# EAGLE design MotorShield (EAGLE 9.6.0)
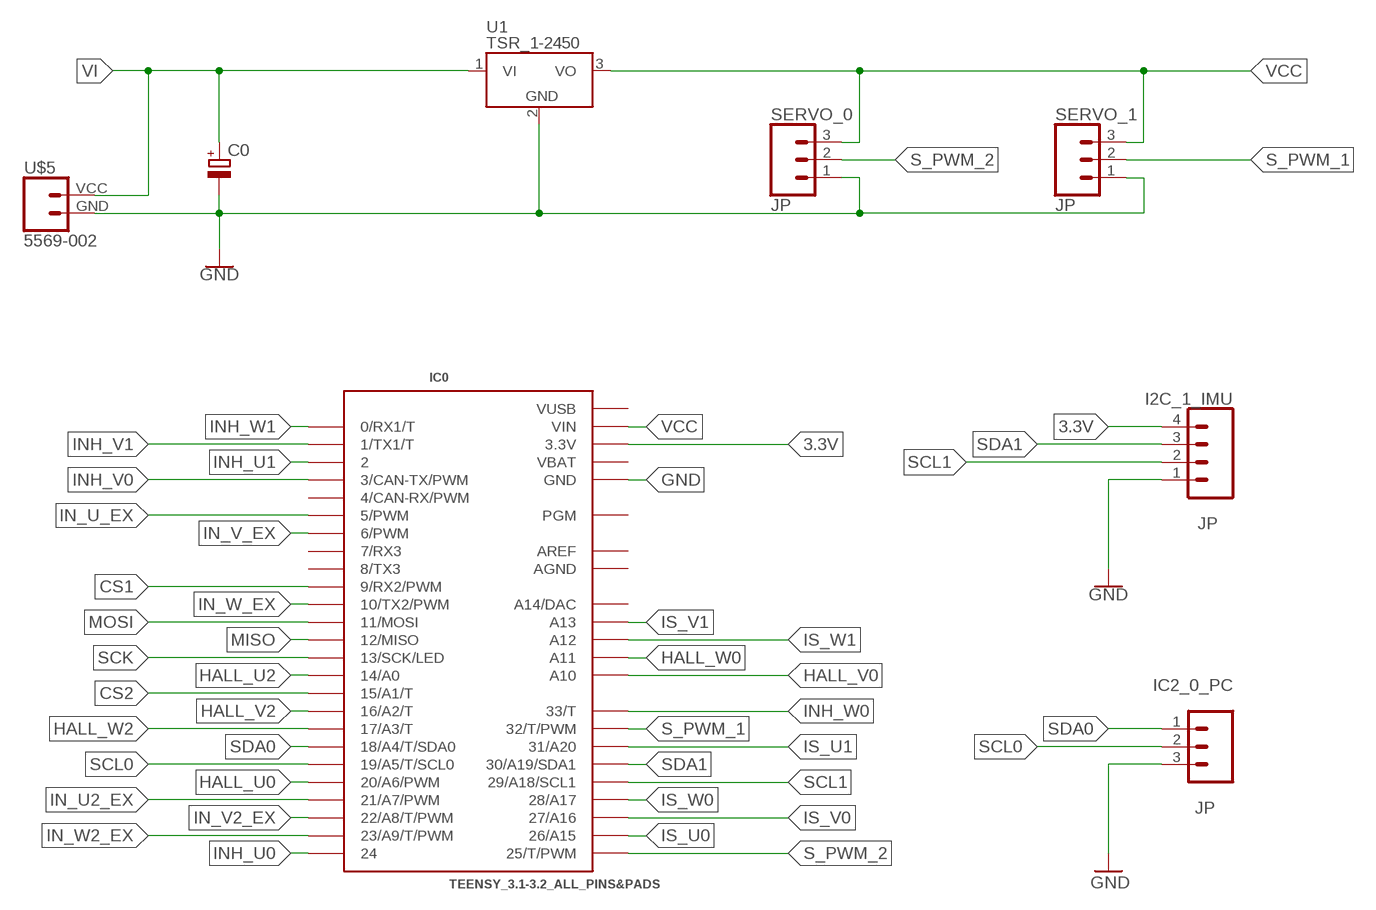
[diagram p0: schematic, sheet 1, part 1 of 2]
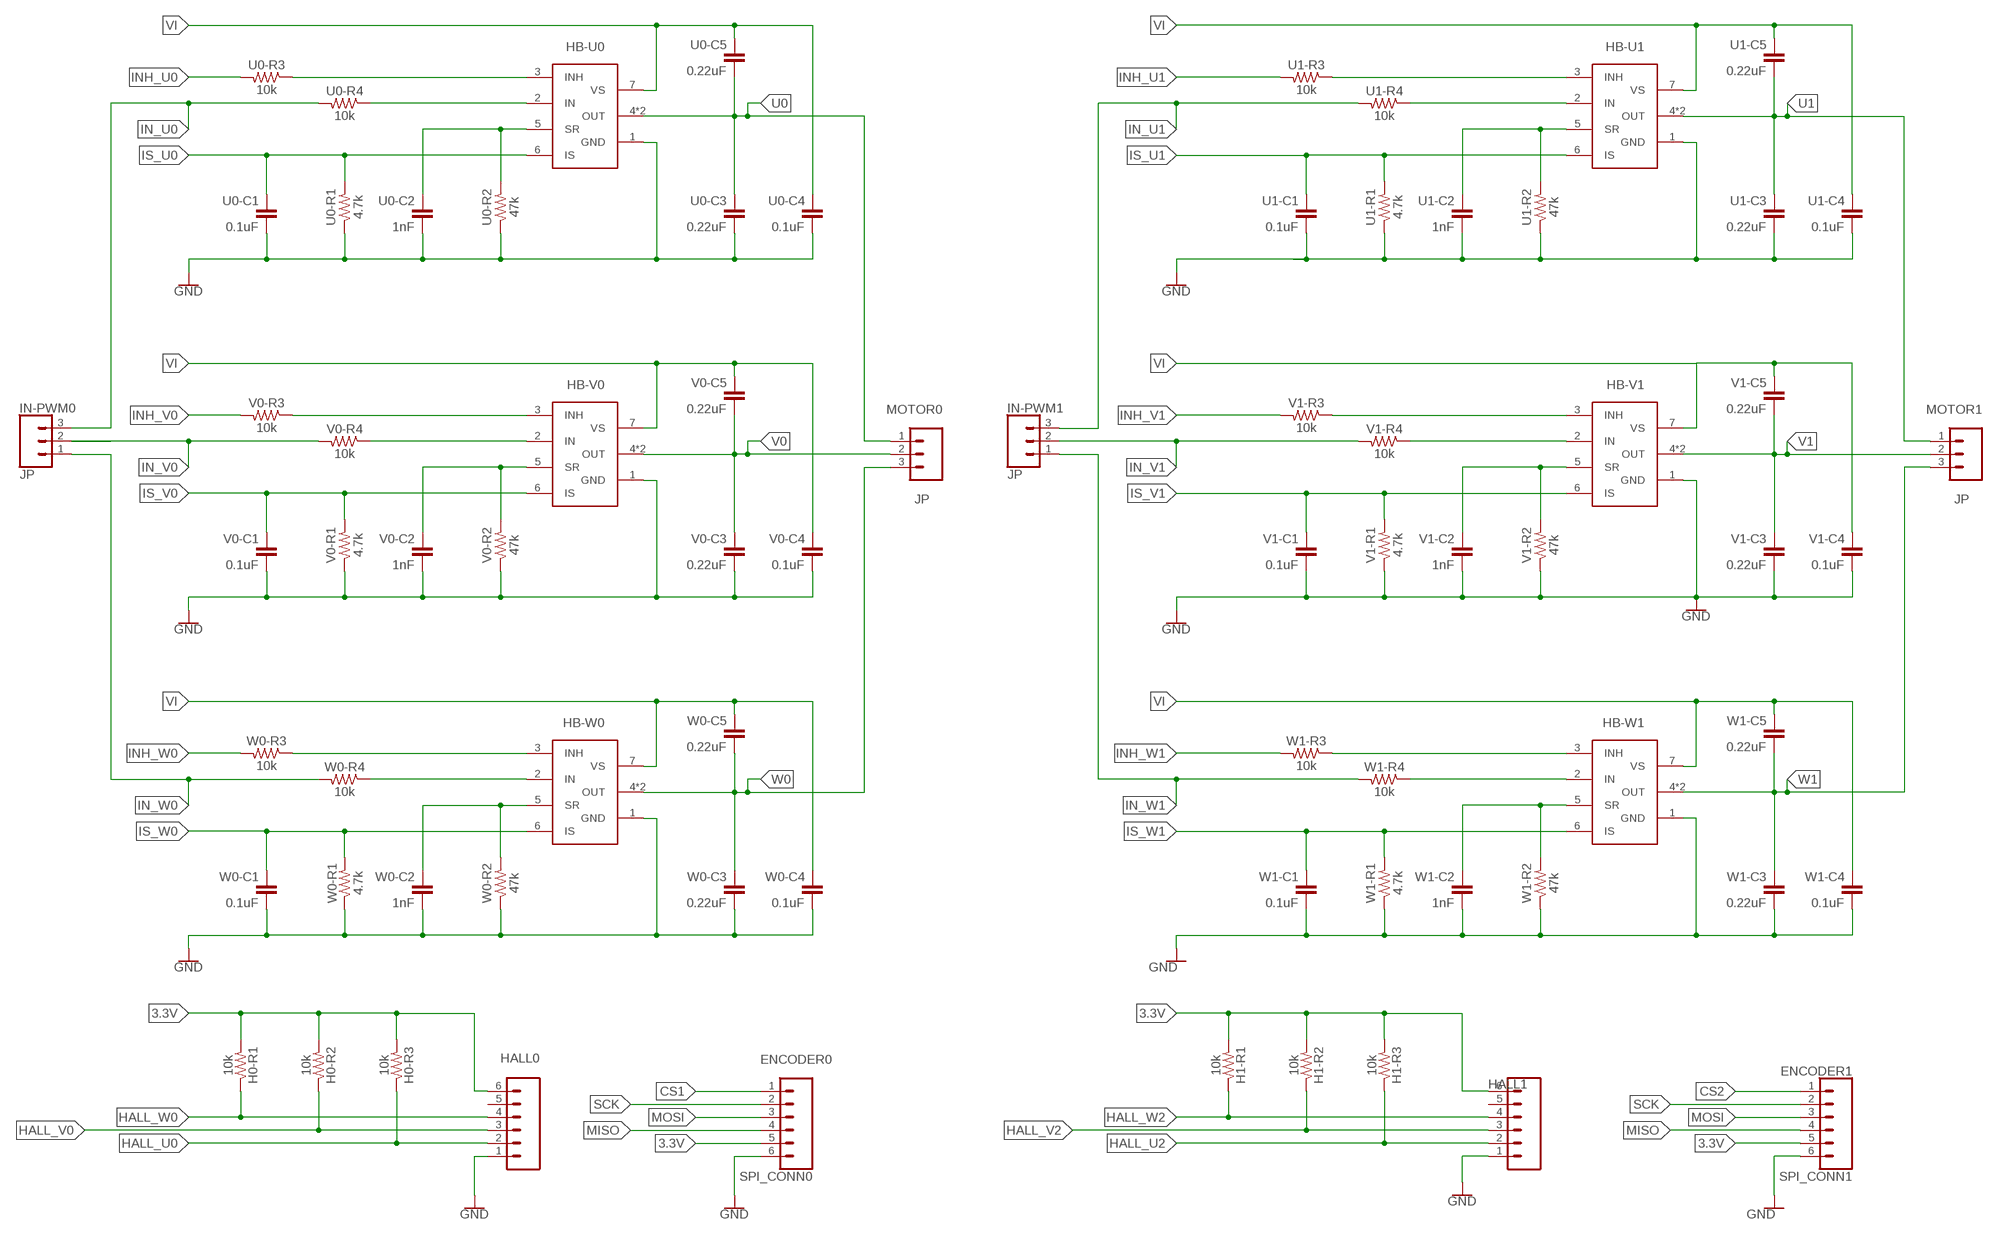
[diagram p1: schematic, sheet 1, part 2 of 2]

## Parts
C0  CPOL-EUE2,5-6E  [E2,5-6E]
H0-R1  10k  10KOHM-0603-1/10W-1%  [0603]
H0-R2  10k  10KOHM-0603-1/10W-1%  [0603]
H0-R3  10k  10KOHM-0603-1/10W-1%  [0603]
H1-R1  10k  10KOHM-0603-1/10W-1%  [0603]
H1-R2  10k  10KOHM-0603-1/10W-1%  [0603]
H1-R3  10k  10KOHM-0603-1/10W-1%  [0603]
HALL0  CONN_06SMD-1MM  [1X06-1MM]
HALL1  CONN_06SMD-1MM  [1X06-1MM]
HB-U0  IFX007TZZZZ  [P-TO263-7-1]
HB-U1  IFX007TZZZZ  [P-TO263-7-1]
HB-V0  IFX007TZZZZ  [P-TO263-7-1]
HB-V1  IFX007TZZZZ  [P-TO263-7-1]
HB-W0  IFX007TZZZZ  [P-TO263-7-1]
HB-W1  IFX007TZZZZ  [P-TO263-7-1]
I2C_1_IMU  JP  CONN_041X04_NO_SILK  [1X04_NO_SILK]
IC0  TEENSY_3.1-3.2_ALL_PINS&PADS  [TEENSY_3.0-3.2_ALL_PINS_&_PADS]
IC2_0_PC  JP  CONN_031X03_NO_SILK  [1X03_NO_SILK]
IN-PWM0  JP  CONN_031X03_NO_SILK  [1X03_NO_SILK]
IN-PWM1  JP  CONN_031X03_NO_SILK  [1X03_NO_SILK]
MOTOR0  JP  CONN_031X03_NO_SILK  [1X03_NO_SILK]
MOTOR1  JP  CONN_031X03_NO_SILK  [1X03_NO_SILK]
SERVO_0  JP  CONN_031X03_NO_SILK  [1X03_NO_SILK]
SERVO_1  JP  CONN_031X03_NO_SILK  [1X03_NO_SILK]
SPI_CONN0  ENCODER0  CONN_06SMD-1MM  [1X06-1MM]
SPI_CONN1  ENCODER1  CONN_06SMD-1MM  [1X06-1MM]
U0-C1  0.1uF  0.1UF-0603-25V-5%  [0603]
U0-C2  1nF  1.0NF/1000PF-0603-50V-10%  [0603]
U0-C3  0.22uF  0.22UF-0603-25V-10%  [0603]
U0-C4  0.1uF  0.1UF-0603-25V-5%  [0603]
U0-C5  0.22uF  0.22UF-0603-25V-10%  [0603]
U0-R1  4.7k  4.7KOHM-0603-1/10W-1%  [0603]
U0-R2  47k  47KOHM-0603-1/10W-1%  [0603]
U0-R3  10k  10KOHM-0603-1/10W-1%  [0603]
U0-R4  10k  10KOHM-0603-1/10W-1%  [0603]
U1  TSR_1-2450  [TSR-1]
U1-C1  0.1uF  0.1UF-0603-25V-5%  [0603]
U1-C2  1nF  1.0NF/1000PF-0603-50V-10%  [0603]
U1-C3  0.22uF  0.22UF-0603-25V-10%  [0603]
U1-C4  0.1uF  0.1UF-0603-25V-5%  [0603]
U1-C5  0.22uF  0.22UF-0603-25V-10%  [0603]
U1-R1  4.7k  4.7KOHM-0603-1/10W-1%  [0603]
U1-R2  47k  47KOHM-0603-1/10W-1%  [0603]
U1-R3  10k  10KOHM-0603-1/10W-1%  [0603]
U1-R4  10k  10KOHM-0603-1/10W-1%  [0603]
U$5  5569-002  [5569-002]
V0-C1  0.1uF  0.1UF-0603-25V-5%  [0603]
V0-C2  1nF  1.0NF/1000PF-0603-50V-10%  [0603]
V0-C3  0.22uF  0.22UF-0603-25V-10%  [0603]
V0-C4  0.1uF  0.1UF-0603-25V-5%  [0603]
V0-C5  0.22uF  0.22UF-0603-25V-10%  [0603]
V0-R1  4.7k  4.7KOHM-0603-1/10W-1%  [0603]
V0-R2  47k  47KOHM-0603-1/10W-1%  [0603]
V0-R3  10k  10KOHM-0603-1/10W-1%  [0603]
V0-R4  10k  10KOHM-0603-1/10W-1%  [0603]
V1-C1  0.1uF  0.1UF-0603-25V-5%  [0603]
V1-C2  1nF  1.0NF/1000PF-0603-50V-10%  [0603]
V1-C3  0.22uF  0.22UF-0603-25V-10%  [0603]
V1-C4  0.1uF  0.1UF-0603-25V-5%  [0603]
V1-C5  0.22uF  0.22UF-0603-25V-10%  [0603]
V1-R1  4.7k  4.7KOHM-0603-1/10W-1%  [0603]
V1-R2  47k  47KOHM-0603-1/10W-1%  [0603]
V1-R3  10k  10KOHM-0603-1/10W-1%  [0603]
V1-R4  10k  10KOHM-0603-1/10W-1%  [0603]
W0-C1  0.1uF  0.1UF-0603-25V-5%  [0603]
W0-C2  1nF  1.0NF/1000PF-0603-50V-10%  [0603]
W0-C3  0.22uF  0.22UF-0603-25V-10%  [0603]
W0-C4  0.1uF  0.1UF-0603-25V-5%  [0603]
W0-C5  0.22uF  0.22UF-0603-25V-10%  [0603]
W0-R1  4.7k  4.7KOHM-0603-1/10W-1%  [0603]
W0-R2  47k  47KOHM-0603-1/10W-1%  [0603]
W0-R3  10k  10KOHM-0603-1/10W-1%  [0603]
W0-R4  10k  10KOHM-0603-1/10W-1%  [0603]
W1-C1  0.1uF  0.1UF-0603-25V-5%  [0603]
W1-C2  1nF  1.0NF/1000PF-0603-50V-10%  [0603]
W1-C3  0.22uF  0.22UF-0603-25V-10%  [0603]
W1-C4  0.1uF  0.1UF-0603-25V-5%  [0603]
W1-C5  0.22uF  0.22UF-0603-25V-10%  [0603]
W1-R1  4.7k  4.7KOHM-0603-1/10W-1%  [0603]
W1-R2  47k  47KOHM-0603-1/10W-1%  [0603]
W1-R3  10k  10KOHM-0603-1/10W-1%  [0603]
W1-R4  10k  10KOHM-0603-1/10W-1%  [0603]

## Nets
3.3V: H0-R1.2 H0-R2.2 H0-R3.2 H1-R1.2 H1-R2.2 H1-R3.2 HALL0.6 HALL1.6 I2C_1_IMU.4 IC0.3.3V IC0.3.3V1(3.3V) IC0.3.3V2(3.3V) SPI_CONN0.5 SPI_CONN1.5
CS1: IC0.9(9/RX2/PWM) SPI_CONN0.1
CS2: IC0.15/A1(15/A1/T) SPI_CONN1.1
GND: C0.- HALL0.1 HALL1.1 HB-U0.1(GND) HB-U1.1(GND) HB-V0.1(GND) HB-V1.1(GND) HB-W0.1(GND) HB-W1.1(GND) I2C_1_IMU.1 IC0.GND IC0.GND1(GND) IC0.GND2(GND) IC2_0_PC.3 SERVO_0.1 SERVO_1.1 SPI_CONN0.6 SPI_CONN1.6 U0-C1.2 U0-C2.1 U0-C3.1 U0-C4.2 U0-R1.1 U0-R2.1 U1-C1.2 U1-C2.1 U1-C3.1 U1-C4.2 U1-R1.1 U1-R2.1 U1.2(GND) U$5.GND V0-C1.2 V0-C2.1 V0-C3.1 V0-C4.2 V0-R1.1 V0-R2.1 V1-C1.2 V1-C2.1 V1-C3.1 V1-C4.2 V1-R1.1 V1-R2.1 W0-C1.2 W0-C2.1 W0-C3.1 W0-C4.2 W0-R1.1 W0-R2.1 W1-C1.2 W1-C2.1 W1-C3.1 W1-C4.2 W1-R1.1 W1-R2.1
HALL_U0: H0-R3.1 HALL0.2 IC0.20/A6(20/A6/PWM)
HALL_U2: H1-R3.1 HALL1.2 IC0.14/A0
HALL_V0: H0-R2.1 HALL0.3 IC0.A10
HALL_V2: H1-R2.1 HALL1.3 IC0.16/A2(16/A2/T)
HALL_W0: H0-R1.1 HALL0.4 IC0.A11
HALL_W2: H1-R1.1 HALL1.4 IC0.17/A3(17/A3/T)
IN_U0: IN-PWM0.3 U0-R4.2
IN_U1: IN-PWM1.3 U1-R4.2
IN_U2_EX: IC0.21/A7(21/A7/PWM)
IN_U_EX: IC0.5(5/PWM)
IN_V0: IN-PWM0.2 V0-R4.2
IN_V1: IN-PWM1.2 V1-R4.2
IN_V2_EX: IC0.22/A8(22/A8/T/PWM)
IN_V_EX: IC0.6(6/PWM)
IN_W0: IN-PWM0.1 W0-R4.2
IN_W1: IN-PWM1.1 W1-R4.2
IN_W2_EX: IC0.23/A9(23/A9/T/PWM)
IN_W_EX: IC0.10(10/TX2/PWM)
INH_U0: IC0.24 U0-R3.2
INH_U1: IC0.2 U1-R3.2
INH_V0: IC0.3(3/CAN-TX/PWM) V0-R3.2
INH_V1: IC0.1(1/TX1/T) V1-R3.2
INH_W0: IC0.33(33/T) W0-R3.2
INH_W1: IC0.0(0/RX1/T) W1-R3.2
IS_U0: HB-U0.6(IS) IC0.26(26/A15) U0-C1.1 U0-R1.2
IS_U1: HB-U1.6(IS) IC0.31(31/A20) U1-C1.1 U1-R1.2
IS_V0: HB-V0.6(IS) IC0.27(27/A16) V0-C1.1 V0-R1.2
IS_V1: HB-V1.6(IS) IC0.A13 V1-C1.1 V1-R1.2
IS_W0: HB-W0.6(IS) IC0.28(28/A17) W0-C1.1 W0-R1.2
IS_W1: HB-W1.6(IS) IC0.A12 W1-C1.1 W1-R1.2
MISO: IC0.12(12/MISO) SPI_CONN0.4 SPI_CONN1.4
MOSI: IC0.11(11/MOSI) SPI_CONN0.3 SPI_CONN1.3
N$1: HB-W0.3(INH) W0-R3.1
N$2: HB-V0.5(SR) V0-C2.2 V0-R2.2
N$3: HB-W0.5(SR) W0-C2.2 W0-R2.2
N$10: HB-U0.5(SR) U0-C2.2 U0-R2.2
N$11: HB-U0.3(INH) U0-R3.1
N$14: HB-U0.2(IN) U0-R4.1
N$17: HB-U1.3(INH) U1-R3.1
N$18: HB-V0.3(INH) V0-R3.1
N$19: HB-U1.2(IN) U1-R4.1
N$20: HB-W0.2(IN) W0-R4.1
N$23: HB-U1.5(SR) U1-C2.2 U1-R2.2
N$24: HB-V0.2(IN) V0-R4.1
N$26: HB-V1.3(INH) V1-R3.1
N$27: HB-V1.2(IN) V1-R4.1
N$29: HB-V1.5(SR) V1-C2.2 V1-R2.2
N$30: HB-W1.3(INH) W1-R3.1
N$31: HB-W1.2(IN) W1-R4.1
N$33: HB-W1.5(SR) W1-C2.2 W1-R2.2
S_PWM_1: IC0.32(32/T/PWM) SERVO_1.2
S_PWM_2: IC0.25(25/T/PWM) SERVO_0.2
SCK: IC0.13(13/SCK/LED) SPI_CONN0.2 SPI_CONN1.2
SCL0: IC0.19/A5(19/A5/T/SCL0) IC2_0_PC.2
SCL1: I2C_1_IMU.2 IC0.29(29/A18/SCL1)
SDA0: IC0.18/A4(18/A4/T/SDA0) IC2_0_PC.1
SDA1: I2C_1_IMU.3 IC0.30(30/A19/SDA1)
U0: HB-U0.4(OUT) HB-U0.8(OUT) MOTOR0.1 U0-C3.2 U0-C5.2
U1: HB-U1.4(OUT) HB-U1.8(OUT) MOTOR1.1 U1-C3.2 U1-C5.2
V0: HB-V0.4(OUT) HB-V0.8(OUT) MOTOR0.2 V0-C3.2 V0-C5.2
V1: HB-V1.4(OUT) HB-V1.8(OUT) MOTOR1.2 V1-C3.2 V1-C5.2
VCC: IC0.VIN SERVO_0.3 SERVO_1.3 U1.3(VO)
VI: C0.+ HB-U0.7(VS) HB-U1.7(VS) HB-V0.7(VS) HB-V1.7(VS) HB-W0.7(VS) HB-W1.7(VS) U0-C4.1 U0-C5.1 U1-C4.1 U1-C5.1 U1.1(VI) U$5.VCC V0-C4.1 V0-C5.1 V1-C4.1 V1-C5.1 W0-C4.1 W0-C5.1 W1-C4.1 W1-C5.1
W0: HB-W0.4(OUT) HB-W0.8(OUT) MOTOR0.3 W0-C3.2 W0-C5.2
W1: HB-W1.4(OUT) HB-W1.8(OUT) MOTOR1.3 W1-C3.2 W1-C5.2
Unconnected: HALL0.5 HALL1.5 IC0.4(4/CAN-RX/PWM) IC0.7(7/RX3) IC0.8(8/TX3) IC0.PGM IC0.RESET/DAC(A14/DAC)

## Power pins joined to a net without a drawn wire
AGND: IC0.AGND
AREF: IC0.AREF
VBAT: IC0.VBAT
VUSB: IC0.VUSB

## Library data of the parts
C0 = rcl:CPOL-EU: POLARIZED CAPACITOR, European symbol; SPICEPREFIX: C
H0-R1-H0-R3 H1-R1-H1-R3 U0-R3 U0-R4 U1-R3 U1-R4 V0-R3 V0-R4 V1-R3 V1-R4 W0-R3 W0-R4 W1-R3 W1-R4 = SparkFun-Resistors:10KOHM: 10kΩ resistor A resistor is a passive two-terminal electrical component that implements electrical resistance as a circuit element. Resistors act to reduce current flow, and, at the same time, act to lower voltage levels within circuits. - Wikipedia; PROD_ID: RES-00824
HALL0 HALL1 SPI_CONN0 SPI_CONN1 = SparkFun-Connectors:CONN_06: Multi connection point. Often used as Generic Header-pin footprint for 0.1 inch spaced/style header connections On any of the 0.1 inch spaced packages, you can populate with these: Break Away Headers - Straight (PRT-00116) Break Away Male Headers - Right Angle (PRT-00553) Female Headers (PRT-00115) Break Away Headers - Machine Pin (PRT-00117) Break Away Female Headers - Swiss Machine Pin (PRT-00743) Arduino Stackable Header - 6 Pin (PRT-09280) For SCREWTERMINALS and SPRING TERMINALS visit here: Screw Terimnals on SparkFun.com (5mm/3.5mm/2.54mm spacing) This device is also useful as a general connection point to wire up your design to another part of your project. Our various solder wires solder well into these plated through hole pads. Hook-Up Wire - Assortment (Stranded, 22 AWG) (PRT-11375) Hook-Up Wire - Assortment (Solid Core, 22 AWG) (PRT-11367) View the entire wire category on our website here; PROD_ID: CONN-08249; SF_ID: GPS-00579
HB-U0 HB-U1 HB-V0 HB-V1 HB-W0 HB-W1 = ITX007T:IFX007T
I2C_1_IMU = SparkFun-Connectors:CONN_04: Multi connection point. Often used as Generic Header-pin footprint for 0.1 inch spaced/style header connections On any of the 0.1 inch spaced packages, you can populate with these: Break Away Headers - Straight (PRT-00116) Break Away Male Headers - Right Angle (PRT-00553) Female Headers (PRT-00115) Break Away Headers - Machine Pin (PRT-00117) Break Away Female Headers - Swiss Machine Pin (PRT-00743) For SCREWTERMINALS and SPRING TERMINALS visit here: Screw Terimnals on SparkFun.com (5mm/3.5mm/2.54mm spacing) This device is also useful as a general connection point to wire up your design to another part of your project. Our various solder wires solder well into these plated through hole pads. Hook-Up Wire - Assortment (Stranded, 22 AWG) (PRT-11375) Hook-Up Wire - Assortment (Solid Core, 22 AWG) (PRT-11367) View the entire wire category on our website here Special notes: Molex polarized connector foot print use with SKU : PRT-08231 with associated crimp pins and housings. 1MM SMD Version SKU: PRT-10208; PROD_ID: CONN-09696
IC0 = Teensy_3_and_LC_Series_Boards_v1.4:TEENSY_3.1-3.2_ALL_PINS&PADS: Footprint for Teensy 3.1 or 3.2 board using all pads and all through-holes. Pads need a 2x7 0.1" SMD header.
IC2_0_PC IN-PWM0 MOTOR0 MOTOR1 SERVO_0 SERVO_1 = SparkFun-Connectors:CONN_03: Multi connection point. Often used as Generic Header-pin footprint for 0.1 inch spaced/style header connections On any of the 0.1 inch spaced packages, you can populate with these: Break Away Headers - Straight (PRT-00116) Break Away Male Headers - Right Angle (PRT-00553) Female Headers (PRT-00115) Break Away Headers - Machine Pin (PRT-00117) Break Away Female Headers - Swiss Machine Pin (PRT-00743) Stackable Header - 3 Pin (Female, 0.1") (PRT-13875) For SCREWTERMINALS and SPRING TERMINALS visit here: Screw Terimnals on SparkFun.com (5mm/3.5mm/2.54mm spacing) This device is also useful as a general connection point to wire up your design to another part of your project. Our various solder wires solder well into these plated through hole pads. Hook-Up Wire - Assortment (Stranded, 22 AWG) (PRT-11375) Hook-Up Wire - Assortment (Solid Core, 22 AWG) (PRT-11367) View the entire wire category on our website here Special notes: Molex polarized connector foot print use with SKU : PRT-08232 with associated crimp pins and housings.
IN-PWM1 = SparkFun-Connectors:CONN_03: Multi connection point. Often used as Generic Header-pin footprint for 0.1 inch spaced/style header connections On any of the 0.1 inch spaced packages, you can populate with these: Break Away Headers - Straight (PRT-00116) Break Away Male Headers - Right Angle (PRT-00553) Female Headers (PRT-00115) Break Away Headers - Machine Pin (PRT-00117) Break Away Female Headers - Swiss Machine Pin (PRT-00743) Stackable Header - 3 Pin (Female, 0.1") (PRT-13875) For SCREWTERMINALS and SPRING TERMINALS visit here: Screw Terimnals on SparkFun.com (5mm/3.5mm/2.54mm spacing) This device is also useful as a general connection point to wire up your design to another part of your project. Our various solder wires solder well into these plated through hole pads. Hook-Up Wire - Assortment (Stranded, 22 AWG) (PRT-11375) Hook-Up Wire - Assortment (Solid Core, 22 AWG) (PRT-11367) View the entire wire category on our website here Special notes: Molex polarized connector foot print use with SKU : PRT-08232 with associated crimp pins and housings.; SPICEPREFIX: J
U0-C1 U0-C4 U1-C1 U1-C4 V0-C1 V0-C4 V1-C1 V1-C4 W0-C1 W0-C4 W1-C1 W1-C4 = SparkFun-Capacitors:0.1UF: 0.1µF ceramic capacitors A capacitor is a passive two-terminal electrical component used to store electrical energy temporarily in an electric field.; PROD_ID: CAP-08604
U0-C2 U1-C2 V0-C2 V1-C2 W0-C2 W1-C2 = SparkFun-Capacitors:1.0NF/1000PF: 1nF/1,000pF ceramic capacitors A capacitor is a passive two-terminal electrical component used to store electrical energy temporarily in an electric field.; PROD_ID: CAP-07886
U0-C3 U0-C5 U1-C3 U1-C5 V0-C3 V0-C5 V1-C3 V1-C5 W0-C3 W0-C5 W1-C3 W1-C5 = SparkFun-Capacitors:0.22UF: 0.22µF ceramic capacitors A capacitor is a passive two-terminal electrical component used to store electrical energy temporarily in an electric field.; PROD_ID: CAP-07822
U0-R1 U1-R1 V0-R1 V1-R1 W0-R1 W1-R1 = SparkFun-Resistors:4.7KOHM: 4.7kΩ resistor A resistor is a passive two-terminal electrical component that implements electrical resistance as a circuit element. Resistors act to reduce current flow, and, at the same time, act to lower voltage levels within circuits. - Wikipedia; PROD_ID: RES-07857
U0-R2 U1-R2 V0-R2 V1-R2 W0-R2 W1-R2 = SparkFun-Resistors:47KOHM: 47kΩ resistor A resistor is a passive two-terminal electrical component that implements electrical resistance as a circuit element. Resistors act to reduce current flow, and, at the same time, act to lower voltage levels within circuits. - Wikipedia; PROD_ID: RES-07871
U1 = _traco_tsr-1:TSR_1-*: TRACO TSR-1 Series Point-of-Load DC/DC-Converters Vi max. 36 V; Vo = (1.2 .. 15)V ±2%; Io = 0 .. 1 A SIP-Package (drop-in replacement for 78xx linear voltage regulators in TO220-package, vertically assembled) Source: www.tracopower.com Technologies: TSR 1- Vi (V) Vo (V) ±2% Io = 0 .. 1 A 24_ ( generic ) 2412 4.6 .. 36 1.2 2415 4.6 .. 36 1.5 2418 4.6 .. 36 1.8 2425 4.6 .. 36 2.5 2433 4.75.. 36 3.3 2450 6.5 .. 36 5.0 2465 9.0 .. 36 6.5 2490 12 .. 36 9.0 24120 15 .. 36 12 24150 18 .. 36 15 Author: Dipl.-Ing. FH Rainer Bayer HHN Hochschule Heilbronn, rainer.bayer@hs-heilbronn.de Ingenieurbüro ing-rb, mail@ing-rb.de
U$5 = 5569-02:5569-002

## Board
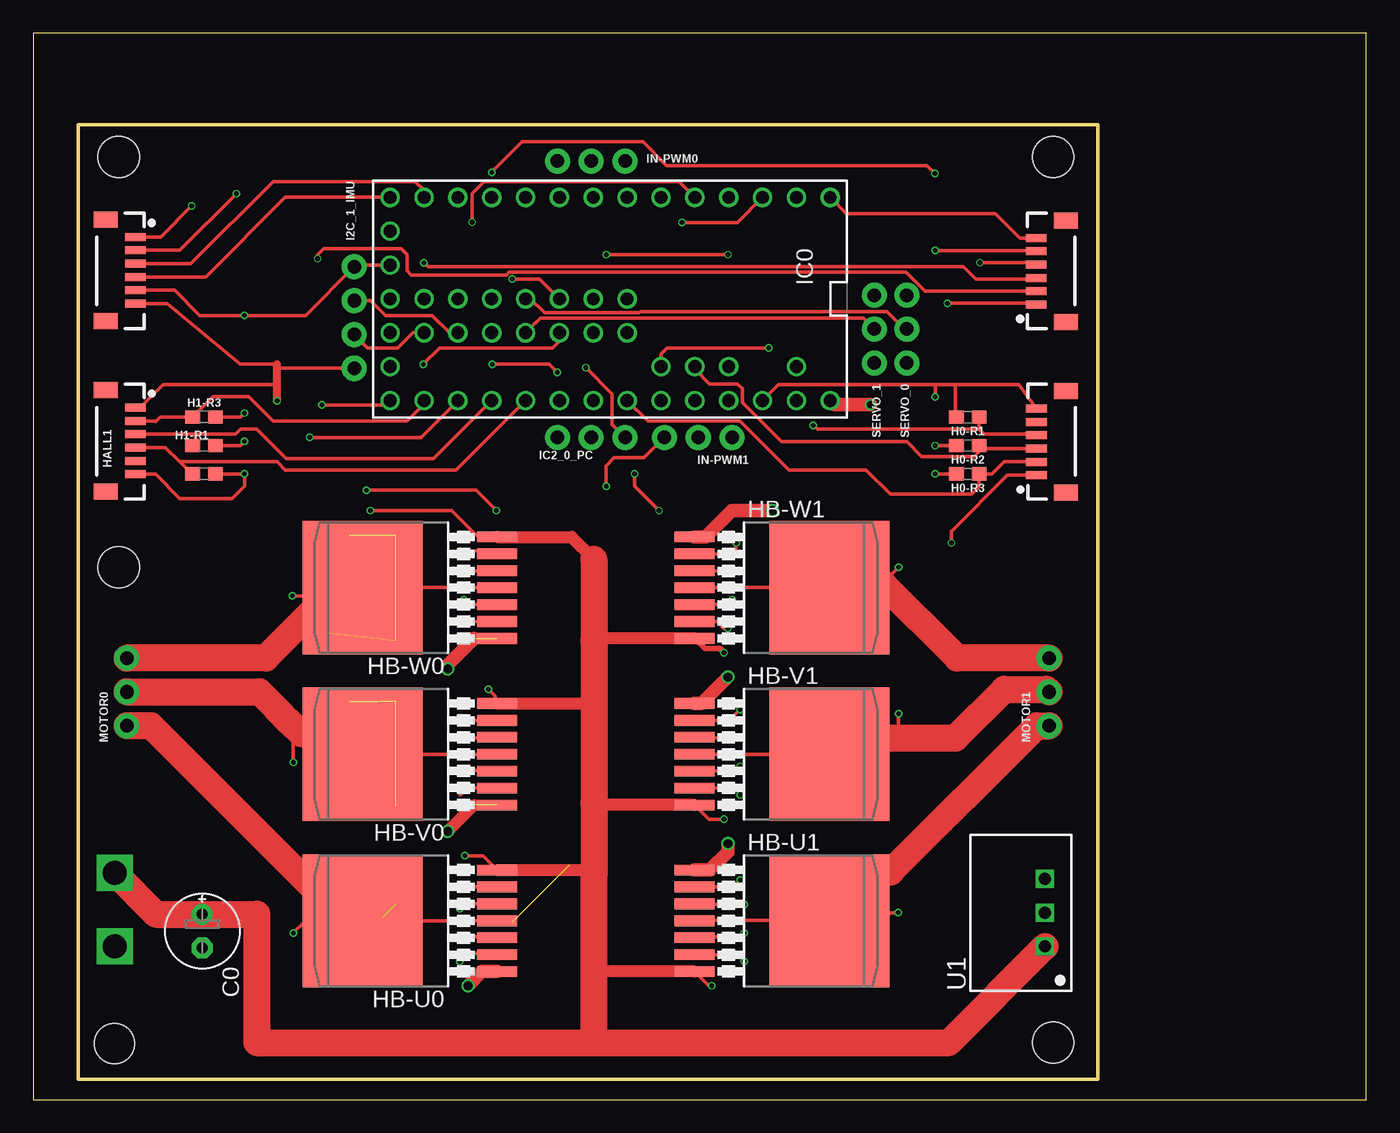
[diagram p2: board, top side]
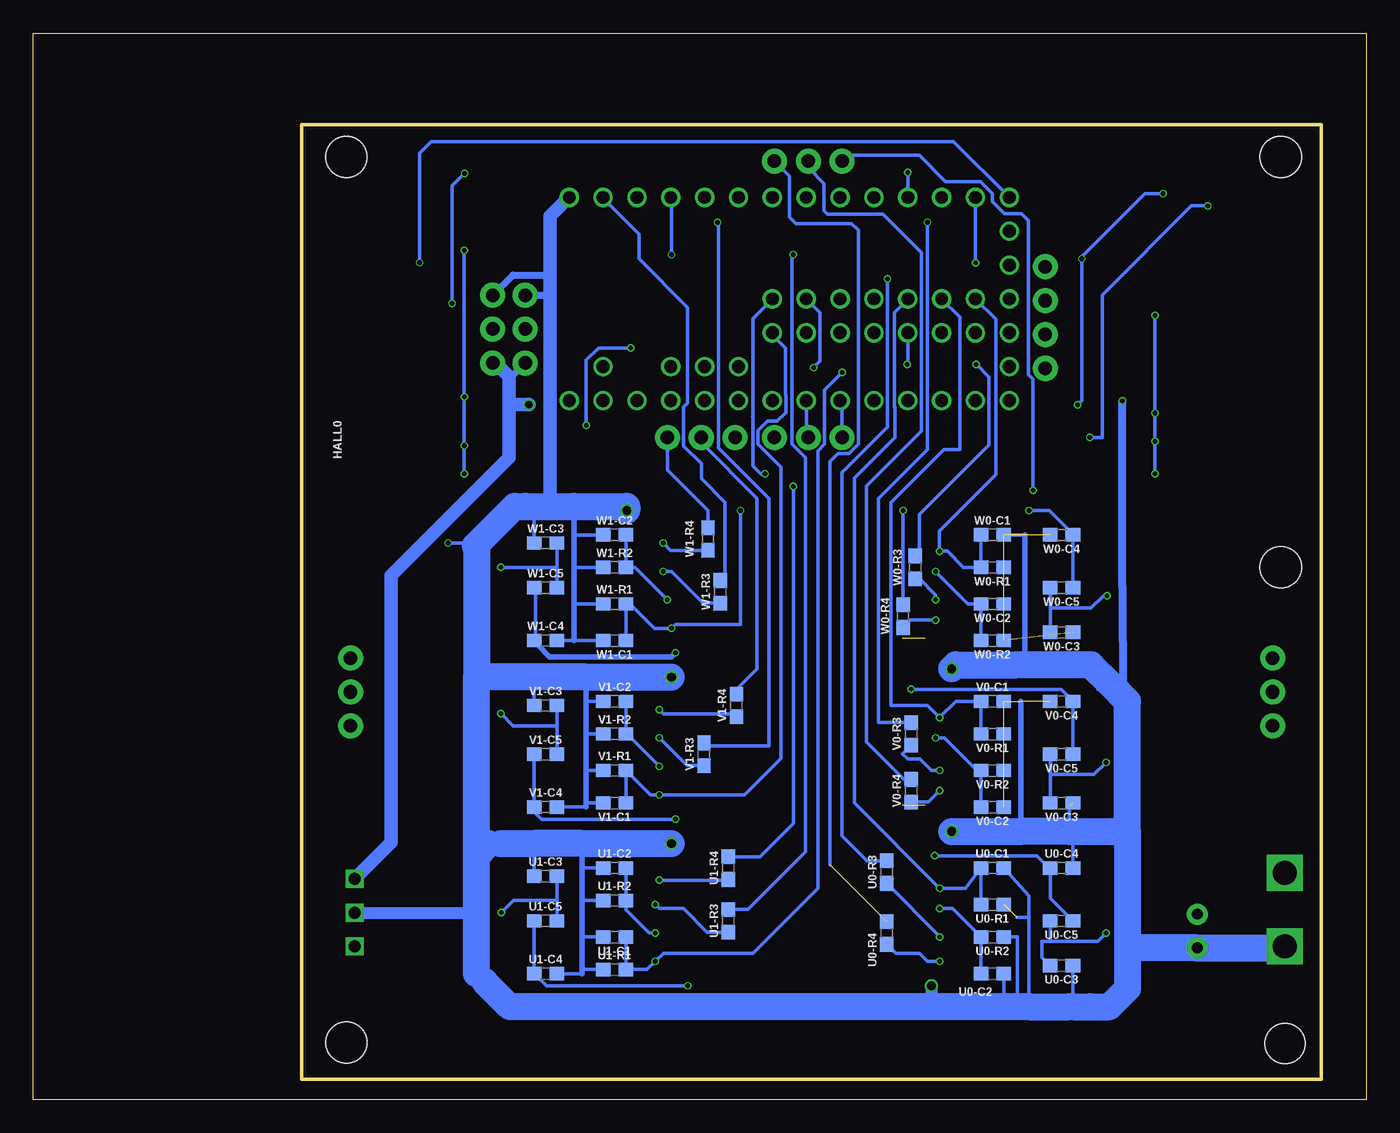
[diagram p3: board, bottom side, seen from below]

Size 100 x 80 mm. Coordinates in mm from the lower left corner, seen from the top.
Outline: 0,0 100,0 100,80 0,80 0,0
Outline: 3.35,1.52 79.86,1.52 79.86,73.15 3.35,73.15 3.35,1.52
Copper layers (1*16): Top 0.018mm / dielectric 1.55mm / Bottom 0.018mm
Design rules "Multi-CB_2L_100æm-Tracks_OL35æm": minimum track width 0.1mm, minimum drill 0.2mm, track to track 0.1mm, track to pad 0.1mm, pad to pad 0.1mm, via to via 0.1mm, smd to smd 0mil, copper to edge 0.2mm, drill to drill 0.2mm, minimum pad ring 0.125mm, minimum via ring 0.1mm, stop-mask expansion 2mil, vias tented up to drill 0.45mm, thermal gap 0.2mm
Holes 3.1 mm at 6.4,70.71 76.5,70.71 76.5,4.27 6.4,39.93

### Footprints (pad centres in the part's own frame; a part is rotated, then mirrored left to right if it is on the bottom)
E2,5-6E = drill 0.813 pad 1.575: + -1.27,0 | drill 0.813 pad 1.575 octagon: - 1.27,0
0603 = smd 1.1 x 1: 1 -0.85,0; 2 0.85,0
1X06-1MM = smd 0.6 x 1.55: 1 -2.54,1.27; 2 -1.54,1.27; 3 -0.54,1.27; 4 0.46,1.27; 5 1.46,1.27; 6 2.46,1.27 | smd 1.2 x 1.8: P$1 -3.84,-0.955; P$2 3.76,-0.955
P-TO263-7-1 = smd 0.8 x 3: 1 -3.81,-9.207; 2 -2.54,-9.207; 3 -1.27,-9.207; 4 0,-9.207; 5 1.27,-9.207; 6 2.54,-9.207; 7 3.81,-9.207 | smd 10 x 9: 8 0,0.895
1X04_NO_SILK = drill 1.016 pad 1.88: 1 0,0; 2 2.54,0; 3 5.08,0; 4 7.62,0
TEENSY_3.0-3.2_ALL_PINS_&_PADS = drill 0.965: 0 -7.62,13.97; 1 -7.62,11.43; 2 -7.62,8.89; 3 -7.62,6.35; 3.3V 7.62,11.43; 3.3V1 -2.54,-16.51; 3.3V2 2.54,-1.27; 4 -7.62,3.81; 5 -7.62,1.27; 6 -7.62,-1.27; 7 -7.62,-3.81; 8 -7.62,-6.35; 9 -7.62,-8.89; 10 -7.62,-11.43; 11 -7.62,-13.97; 12 -7.62,-16.51; 13 7.62,-16.51; 14/A0 7.62,-13.97; 15/A1 7.62,-11.43; 16/A2 7.62,-8.89; 17/A3 7.62,-6.35; 18/A4 7.62,-3.81; 19/A5 7.62,-1.27; 20/A6 7.62,1.27; 21/A7 7.62,3.81; 22/A8 7.62,6.35; 23/A9 7.62,8.89; 24 0,-3.81; 25 0,-6.35; 26 0,-8.89; 27 0,-11.43; 28 0,-13.97; 29 2.54,-13.97; 30 2.54,-11.43; 31 2.54,-8.89; 32 2.54,-6.35; 33 2.54,-3.81; A10 5.08,6.35; A11 5.08,3.81; A12 0,1.27; A13 2.54,1.27; AGND 7.62,13.97; AREF 5.08,8.89; GND -7.62,16.51; GND1 0,-16.51; GND2 0,-1.27; PGM 2.54,-16.51; RESET/DAC 5.08,-16.51; VBAT -5.08,-16.51; VIN 7.62,16.51; VUSB 5.08,13.97
1X03_NO_SILK = drill 1.016 pad 1.88: 1 0,0; 2 2.54,0; 3 5.08,0
TSR-1 = drill 0.9 square: 1 -2.54,0; 2 0,0; 3 2.54,0
5569-002 = drill 1.8 square: GND 0,0; VCC 0,5.5 | hole 3: 0,-7.3

### Placement (x,y rotation side)
C0  12.67,12.64 270 top
H0-R1  70.1,51.21 180 top
H0-R2  70.1,49.07 180 top
H0-R3  70.1,46.94 180 top
H1-R1  12.8,46.94 0 top
H1-R2  12.8,49.07 0 top
H1-R3  12.8,51.21 0 top
HALL0  76.53,49.38 90 top
HALL1  6.4,49.38 270 top
HB-U0  25.6,13.41 90 top
HB-U1  58.83,13.41 270 top
HB-V0  25.6,25.91 90 top
HB-V1  58.83,25.91 270 top
HB-W0  25.6,38.4 90 top
HB-W1  58.83,38.4 270 top
I2C_1_IMU  24.08,54.86 90 top
IC0  43.28,60.07 270 top
IC2_0_PC  39.32,49.68 0 top
IN-PWM0  39.32,70.41 0 top
IN-PWM1  52.43,49.68 180 top
MOTOR0  7.01,28.04 90 top
MOTOR1  76.2,28.04 90 top
SERVO_0  65.53,60.35 270 top
SERVO_1  63.09,60.35 270 top
SPI_CONN0  76.5,62.18 90 top
SPI_CONN1  6.4,62.18 270 top
U0-C1  28.04,17.37 0 bottom
U0-C2  28.04,9.45 180 bottom
U0-C3  22.86,10.06 180 bottom
U0-C4  22.86,17.37 0 bottom
U0-C5  22.86,13.41 180 bottom
U0-R1  28.04,14.63 180 bottom
U0-R2  28.04,12.19 180 bottom
U0-R3  35.97,17.07 90 bottom
U0-R4  35.97,12.5 90 bottom
U1  75.9,14.02 90 top
U1-C1  56.39,12.19 180 bottom
U1-C2  56.39,17.37 0 bottom
U1-C3  61.57,16.76 0 bottom
U1-C4  61.57,9.45 0 bottom
U1-C5  61.57,13.41 0 bottom
U1-R1  56.39,9.75 0 bottom
U1-R2  56.39,14.94 0 bottom
U1-R3  47.85,13.41 90 bottom
U1-R4  47.85,17.37 90 bottom
U$5  6.1,11.5 0 bottom
V0-C1  28.04,29.87 0 bottom
V0-C2  28.04,21.95 180 bottom
V0-C3  22.86,22.25 180 bottom
V0-C4  22.86,29.87 180 bottom
V0-C5  22.86,25.91 180 bottom
V0-R1  28.04,27.43 180 bottom
V0-R2  28.04,24.69 180 bottom
V0-R3  34.14,27.43 90 bottom
V0-R4  34.14,23.16 90 bottom
V1-C1  56.39,22.25 180 bottom
V1-C2  56.39,29.87 0 bottom
V1-C3  61.57,29.57 0 bottom
V1-C4  61.57,21.95 0 bottom
V1-C5  61.57,25.91 0 bottom
V1-R1  56.39,24.69 0 bottom
V1-R2  56.39,27.43 0 bottom
V1-R3  49.68,25.91 90 bottom
V1-R4  47.24,29.57 90 bottom
W0-C1  28.04,42.37 0 bottom
W0-C2  28.04,37.19 180 bottom
W0-C3  22.86,35.05 180 bottom
W0-C4  22.86,42.37 180 bottom
W0-C5  22.86,38.4 180 bottom
W0-R1  28.04,39.93 180 bottom
W0-R2  28.04,34.44 180 bottom
W0-R3  33.83,39.93 90 bottom
W0-R4  34.75,36.27 90 bottom
W1-C1  56.39,34.44 180 bottom
W1-C2  56.39,42.37 0 bottom
W1-C3  61.57,41.76 0 bottom
W1-C4  61.57,34.44 0 bottom
W1-C5  61.57,38.4 0 bottom
W1-R1  56.39,37.19 0 bottom
W1-R2  56.39,39.93 0 bottom
W1-R3  48.46,38.1 90 bottom
W1-R4  49.38,42.06 90 bottom

### Tracks (layer width: path | path; a pad name or v marks a point on that pad's centre or on a via)
3.3V  (via drill 0.35)
  Top 0.254: IC0.3.3V1 24.21,62.61 I2C_1_IMU.4 20.42,58.83 v15.85,58.83 12.5,58.83 10.6,60.72 SPI_CONN1.5 | H0-R2.2 v67.67,49.07 | H0-R3.2 v67.67,46.94 | HALL0.6 73.96,53.65 69.19,53.65 | H0-R1.2 69.19,51.27 69.19,53.65 | 67.67,53.65 55.91,53.65 IC0.3.3V | v15.85,51.51 15.54,51.21 H1-R3.2 | H1-R2.2 15.54,49.07 v15.85,49.38 | H1-R1.2 v15.85,46.94 15.85,46.02 14.94,45.11 10.97,45.11 9.17,46.92 HALL1.6 | v67.67,52.73 67.67,53.65 | 67.67,53.65 69.19,53.65 | SPI_CONN0.5 75.17,63.7 v67.67,63.7
  Bottom 0.254: v67.67,46.94 v67.67,49.07 v67.67,52.73 v67.67,63.7 | v15.85,58.83 v15.85,51.51 v15.85,49.38 v15.85,46.94
CS1  (via drill 0.35)
  Top 0.254: v34.39,69.57 36.68,71.86 45.74,71.86 47.52,70.08 67.06,70.08 v67.64,69.49 | v68.58,59.74 75.13,59.74 SPI_CONN0.1
  Bottom 0.254: IC0.9 v34.39,69.57 | v67.64,69.49 68.58,68.56 v68.58,59.74
CS2  (via drill 0.35)
  Top 0.254: IC0.15/A1 29.08,49.68 v20.73,49.68 | v11.89,67.06 9.55,64.72 SPI_CONN1.1
  Bottom 0.254: v20.73,49.68 19.81,49.68 19.81,60.35 13.11,67.06 v11.89,67.06
GND  (via drill 0.35, 0.65)  (14 unrouted)
  Top 0.254: v41.45,54.91 43.43,52.93 43.43,50.65 IC2_0_PC.3 | HALL0.1 73.1,46.84 68.91,42.65 68.89,42.67 v68.89,41.76 | SPI_CONN1.6 10.05,59.72 15.51,55.17 18.29,55.17 | 18.29,53.65 9.75,53.65 8.03,51.92 HALL1.1 | I2C_1_IMU.1 18.29,54.86 | IC0.GND 61.02,66.47 72.19,66.47 73.9,64.75 74.02,64.64 SPI_CONN0.6
  Top 0.61: v18.29,52.43 18.29,53.65 18.29,54.86 18.29,55.17
  Top 0.889: 33.07,22.1 v31.09,20.12
  Top 1.016: 33.07,34.59 31.09,32.61 v31.09,32.31 | HB-W1.1 50.44,42.22 52.43,44.2 v55.47,44.2 | HB-U0.1 33.68,9.6 v32.61,8.53 | HB-U1.1 50.75,17.22 52.12,18.59 v52.12,19.2 | HB-V1.1 50.14,29.72 v52.12,31.7
  Bottom 0.254: 22.25,22.01 22.25,20.12 22,19.86 22,19.61 22.01,19.59 U0-C4.2 | U0-C1.2 25.3,15.3 25.3,13.54 | 25.6,42.37 W0-C1.2 | U1-C2.1 58.83,17.37 | U1-R2.1 58.83,14.94 | U1-R1.1 58.83,9.75 | 58.83,9.45 U1-C4.2 | V1-R1.1 58.52,24.69 | V1-R2.1 58.52,27.43 | V1-C2.1 58.52,29.87 | 63.09,44.5 62.42,43.83 W1-C3.1 | W1-R1.1 59.44,37.19 | W1-R2.1 59.44,39.93 | W1-C2.1 59.44,42.37 | W1-C1.2 59.44,34.44 W1-C4.2 | 26.52,6.96 26.47,7.01 26.36,7.01 26.19,7.19 26.19,12.22 26.21,12.19 U0-R2.1 | 25.3,13.54 25.3,6.96 | IC0.GND2 41,59.04 41,55.41 41.45,54.95 v41.45,54.91 | V1-C3.1 62.42,31.7 | U1-C3.1 62.42,19.2 | v68.89,41.76 67.06,41.76 66.84,41.54 66.75,41.45 | V1-C1.2 58.52,22.25 | 58.52,21.95 V1-C4.2 | U1-C1.2 58.8,12.19 58.83,12.17 | U0-C2.1 27.19,7 27.23,6.96 | 26.21,13.65 25.41,13.65 25.3,13.54 | 61.24,61.87 61.21,61.85 61.21,61.01 | 65.84,19.2 64.92,19.2 | U0-C3.1 22.01,6.96 | 22.25,6.96 20.73,6.96 | 19.51,31.48 19.12,31.09 19.43,30.79 20.12,30.79 19.51,31.39 19.51,31.48
  Bottom 0.406: 25.91,29.87 25.91,20.12 | 25.6,42.37 25.6,32.92 25.91,32.61 26.21,32.61 | 58.83,9.45 58.83,9.75 58.83,12.17 58.83,14.94 58.83,17.37 58.83,19.2 | 58.52,31.7 58.52,29.87 58.52,27.43 58.52,24.69 58.52,22.25 58.52,21.95 | 59.44,44.5 59.44,42.37 59.44,39.93 59.44,37.19 59.44,34.44
  Bottom 0.508: SERVO_1.1 61.24,60.35 | SERVO_0.1 64.01,61.87 61.24,61.87
  Bottom 0.61: 18.24,30.21 18.29,38.4 18.29,38.41 v18.29,52.43
  Bottom 0.889: U1.2 66.75,14.02 | 66.75,9.45 66.14,8.84 | v32.61,8.53 32.61,6.96 | 18.86,30.83 20.64,32.61
  Bottom 1.016: IC0.GND 61.21,66.27 61.21,61.01 | 61.24,61.87 61.24,60.35 61.24,44.5
  Bottom 2.032: 17.9,20.12 17.9,29.87 18.24,30.21 18.86,30.83 19.12,31.09 20.64,32.61 25.91,32.61 | v55.47,44.2 55.47,44.5 59.44,44.5 61.24,44.5 63.09,44.5 63.88,44.5 66.84,41.54 | 17.9,20.12 22.25,20.12 25.91,20.12 v31.09,20.12 | v52.12,19.2 58.83,19.2 62.42,19.2 64.92,19.2 | v52.12,31.7 58.52,31.7 62.42,31.7 66.75,31.7 | U$5.GND 6.22,11.37 C0.- 17.9,11.37 | 22.25,6.96 25.3,6.96 26.52,6.96 27.23,6.96 32.61,6.96 64.26,6.96 66.14,8.84 | 17.9,20.12 17.9,11.37 | 17.9,11.37 17.9,8.31 19.25,6.96 20.73,6.96 22.01,6.96 | v31.09,32.31 30.79,32.61 26.21,32.61 | 66.75,18.29 65.84,19.2 | 66.75,9.45 66.75,14.02 66.75,18.29 | 66.75,18.29 66.75,31.7 | 66.75,41.45 66.75,31.7
HALL_U0
  Top 0.254: HALL0.2 74.77,47.85 72.85,47.85 71.93,46.94 H0-R3.1 70.95,45.96 70.41,45.41 64.31,45.41 62.48,47.24 56.69,47.24 53.03,50.9 46.1,50.9 IC0.20/A6
HALL_U2
  Top 0.254: HALL1.2 9.13,50.92 9.18,50.87 9.51,51.21 H1-R3.1 13.48,52.73 16.15,52.73 17.98,50.9 28.04,50.9 29.31,52.17 IC0.14/A0
HALL_V0
  Top 0.254: HALL0.3 75.25,48.83 71.2,48.83 H0-R2.1 70.95,48.6 70.61,48.26 66.65,48.26 65.53,49.38 56.12,49.38 53.19,52.31 53.19,53.35 52.85,53.7 50.72,53.7 49.63,54.79 IC0.A10
HALL_V2
  Top 0.254: HALL1.3 12.19,49.92 | IC0.16/A2 30.03,48.09 18.97,48.09 16.76,50.29 15.54,50.29 15.17,49.92 12.19,49.92 | 12.19,49.92 12.19,49.31 H1-R2.1
HALL_W0  (via drill 0.35)
  Top 0.254: HALL0.4 75.23,49.94 71.31,49.94 70.95,50.29 | IC0.A11 47.09,55.93 47.55,56.39 v55.17,56.39 | 70.95,50.29 58.83,50.29 v58.52,50.6 | H0-R1.1 70.95,50.29
  Bottom 0.254: v58.52,50.6 58.52,55.47 57.61,56.39 v55.17,56.39
HALL_W2
  Top 0.152: 11.92,46.91 H1-R1.1
  Top 0.254: IC0.17/A3 31.73,47.24 18.96,47.24 18.93,47.21 18.29,47.85 10.97,47.85 | 11.92,46.91 10.97,47.85 | 10.97,47.85 9.91,48.92 HALL1.4
IN_U0  (1 unrouted)
  Bottom 0.254: 40.23,17.61 40.23,47.85 39.62,48.46 38.81,48.46 38.1,49.18 38.1,65.23 38.61,65.73 42.8,65.73 43.26,66.19 43.26,69.27 IN-PWM0.3
IN_U1  (via drill 0.35)
  Top 0.254: v42.98,46.02 42.98,47.55 43.59,48.16 45.82,48.16 IN-PWM1.3
  Bottom 0.254: U1-R4.2 45.48,18.22 42.98,20.73 v42.98,46.02
IN_V0
  Bottom 0.254: V0-R4.2 34.68,24.02 37.49,26.82 37.49,46.02 33.38,50.14 33.38,63.55 36.27,66.45 40.41,66.45 40.66,66.7 40.66,68.73 41.86,69.93 IN-PWM0.2
IN_V1
  Bottom 0.254: V1-R4.2 47.24,30.79 45.72,32.31 45.72,45.11 49.89,49.28 IN-PWM1.2
IN_W0  (via drill 0.35)
  Top 0.254: v34.75,44.2 33.22,45.72 v24.99,45.72
  Bottom 0.254: W0-R4.2 v34.75,44.2 | v24.99,45.72 24.99,54.05 25.35,54.41 25.35,65.94 25.88,66.47 27.15,66.47 28.04,67.36 28.04,67.97 28.96,68.89 31.57,68.89 33.53,70.84 38.89,70.84 IN-PWM0.1
IN_W1
  Bottom 0.254: W1-R4.2 49.38,44.2 52.43,47.24 IN-PWM1.1
INH_U0  (via drill 0.35)
  Top 0.254: v35.92,61.57 37.97,61.57 IC0.24
  Bottom 0.254: U0-R3.2 37.44,17.92 39.32,19.8 39.32,47.04 35.92,50.45 v35.92,61.57
INH_U1  (via drill 0.35)
  Top 0.254: v52.12,63.4 v42.98,63.4
  Bottom 0.254: U1-R3.2 46.39,14.26 42.06,18.59 42.06,48.16 43.08,49.18 43.08,63.3 v42.98,63.4 | v52.12,63.4 52.12,67.64 IC0.2
INH_V0  (via drill 0.35)
  Top 0.254: IC0.3 48.44,68.89 33.83,68.89 32.92,67.97 v32.92,65.84
  Bottom 0.254: V0-R3.2 36.58,28.28 36.58,45.11 32.92,48.77 v32.92,65.84
INH_V1  (via drill 0.35)
  Top 0.254: v48.67,65.81 52.83,65.81 IC0.1
  Bottom 0.254: V1-R3.2 49.47,26.55 44.81,26.55 44.81,45.09 48.59,48.87 48.59,65.73 v48.67,65.81
INH_W0  (via drill 0.35)
  Top 0.254: IC0.33 39.47,56.9 38.96,56.39 30.48,56.39 v29.26,55.17
  Bottom 0.254: W0-R3.2 33.53,41.08 33.53,43.89 28.3,49.12 28.3,54.2 v29.26,55.17
INH_W1
  Bottom 0.254: W1-R3.2 48.11,39.31 48.11,44.81 49.89,46.58 49.89,47.72 51.21,49.04 51.21,51.95 50.9,52.26 50.9,59.44 54.56,63.09 54.56,64.92 57.25,67.61 IC0.0
IS_U0  (via drill 0.35)
  Top 0.254: HB-U0.6 32.11,15.95 v32,15.85
  Bottom 0.254: U0-R1.2 U0-C1.1 30.08,15.85 v32,15.85 38.41,22.25 38.41,46.63 35.36,49.68 35.36,51.95 35.41,52.01 35.41,59.05 IC0.26
IS_U1  (via drill 0.35)
  Top 0.254: HB-U1.6 52.83,10.87 v53.34,10.36 | v39.32,54.56 38.71,55.17 v34.44,55.17
  Bottom 0.254: v39.32,54.56 40.64,53.24 40.64,49.18 41.15,48.67 41.15,15.85 46.02,10.97 52.73,10.97 v53.34,10.36 53.95,9.75 U1-R1.2 U1-C1.1 | v34.44,55.17 34.39,55.22 IC0.31
IS_V0  (via drill 0.35)
  Top 0.254: HB-V0.6 32.21,28.45 v32,28.65
  Bottom 0.254: V0-R1.2 V0-C1.1 30.79,29.87 v32,28.65 32.92,29.57 35.03,29.57 35.66,29.57 35.66,44.81 31.7,48.77 30.48,48.77 30.48,58.7 IC0.27
IS_V1  (via drill 0.35)
  Top 0.254: v53.03,22.86 53.03,23.37 HB-V1.6
  Bottom 0.254: V1-C1.1 V1-R1.2 53.71,22.86 v53.03,22.86 46.63,22.86 43.89,25.6 43.89,47.45 45.62,49.18 45.62,50.19 44.9,50.9 44.2,50.9 43.54,51.56 43.54,52.85 43.59,52.9 43.59,56.39 44.55,57.35 IC0.A13
IS_W0  (via drill 0.35)
  Top 0.254: v32,41.15 34.61,41.15 HB-W0.6
  Bottom 0.254: W0-C1.1 W0-R1.2 30.21,39.93 31.43,41.15 v32,41.15 32,42.67 27.79,46.89 27.79,58.55 IC0.28
IS_W1  (via drill 0.35)
  Top 0.254: v52.12,35.36 51.82,35.36 51.31,35.87 HB-W1.6 | v45.11,46.94 45.11,46.02 v46.94,44.2
  Bottom 0.254: v46.94,44.2 46.94,35.66 51.82,35.66 v52.12,35.36 53.4,35.36 55.23,37.19 W1-R1.2 W1-C1.1 | IC0.A12 46.02,58.6 46.02,51.21 46.06,51.24 46.02,51.27 46.02,47.55 45.41,46.94 v45.11,46.94
MISO  (via drill 0.35)
  Top 0.254: IC0.12 18.91,67.69 12.94,61.72 SPI_CONN1.4 | 71.09,62.86 v71.02,62.79 75.08,62.79 SPI_CONN0.4
  Bottom 0.254: IC0.12 30.96,71.88 70.16,71.88 71.02,71.02 v71.02,62.79
MOSI  (via drill 0.35)
  Top 0.254: IC0.11 29.31,68.22 28.65,68.89 17.98,68.89 11.82,62.72 SPI_CONN1.3 | v29.31,62.79 29.61,62.48 69.8,62.48 70.71,61.57 75.17,61.57 SPI_CONN0.3
  Bottom 0.254: IC0.11 v29.31,62.79
N$1  (via drill 0.35)
  Top 0.254: v32.31,37.49 32.66,37.13 HB-W0.3
  Bottom 0.254: W0-R3.1 33.53,39.08 32.31,37.86 v32.31,37.49
N$2  (via drill 0.35)
  Top 0.254: v32.31,27.13 34.76,27.13 HB-V0.5
  Bottom 0.254: V0-C2.2 V0-R2.2 29.2,24.69 31.64,27.13 v32.31,27.13
N$3  (via drill 0.35)
  Top 0.254: v32.31,39.62 32.36,39.67 HB-W0.5
  Bottom 0.254: W0-R2.2 W0-C2.2 29.87,37.19 v32.31,39.62
N$10  (via drill 0.35)
  Top 0.254: v32,14.33 32.36,14.68 HB-U0.5
  Bottom 0.254: U0-C2.2 U0-R2.2 31.02,14.33 v32,14.33
N$11  (via drill 0.35)
  Top 0.254: v32,12.19 34.76,12.19 HB-U0.3
  Bottom 0.254: U0-R3.1 32,12.26 v32,12.19
N$14  (via drill 0.35)
  Top 0.254: v32,10.36 32.61,10.97 34.71,10.97 HB-U0.2
  Bottom 0.254: v32,10.36 32.92,10.36 33.53,10.97 35.29,10.97 U0-R4.1
N$17  (via drill 0.35)
  Top 0.254: HB-U1.3 49.62,14.63 v53.34,14.63
  Bottom 0.254: v53.34,14.63 53.03,14.33 51.21,14.33 49.44,12.56 U1-R3.1
N$18  (via drill 0.35)
  Top 0.254: HB-V0.3 34.76,24.69 v32,24.69
  Bottom 0.254: v32,24.69 32.6,24.69 33.47,25.55 34.4,25.55 34.78,25.94 V0-R3.1
N$19  (via drill 0.35)
  Top 0.254: v53.03,16.46 52.53,15.95 HB-U1.2
  Bottom 0.254: v53.03,16.46 47.92,16.46 U1-R4.1
N$20  (via drill 0.35)
  Top 0.254: HB-W0.2 32.41,35.87 v32.31,35.97
  Bottom 0.254: v32.31,35.97 34.2,35.97 W0-R4.1
N$23  (via drill 0.35)
  Top 0.254: HB-U1.5 49.67,12.19 53.03,12.19 v53.34,12.5
  Bottom 0.254: v53.34,12.5 53.8,12.5 55.54,14.24 U1-R2.2 U1-C2.2
N$24  (via drill 0.35)
  Top 0.254: HB-V0.2 32.51,23.37 32,22.86 v32,23.16
  Bottom 0.254: v32,23.16 32.85,22.32 V0-R4.1
N$26  (via drill 0.35)
  Top 0.254: HB-V1.3 49.67,27.13 v53.03,27.13
  Bottom 0.254: v53.03,27.13 50.97,25.06 V1-R3.1
N$27  (via drill 0.35)
  Top 0.254: HB-V1.2 52.22,28.45 v53.03,29.26
  Bottom 0.254: V1-R4.1 47.46,28.93 52.71,28.93 v53.03,29.26
N$29  (via drill 0.35)
  Top 0.254: HB-V1.5 52.68,24.64 v53.03,24.99
  Bottom 0.254: V1-C2.2 V1-R2.2 55.47,27.43 v53.03,24.99
N$30  (via drill 0.35)
  Top 0.254: HB-W1.3 52.68,39.67 v52.73,39.62
  Bottom 0.254: v52.73,39.62 52.12,39.62 49.75,37.25 W1-R3.1
N$31  (via drill 0.35)
  Top 0.254: v52.73,41.76 52.73,40.95 HB-W1.2
  Bottom 0.254: v52.73,41.76 52.19,41.21 W1-R4.1
N$33  (via drill 0.35)
  Top 0.254: HB-W1.5 52.07,37.13 v52.43,37.49
  Bottom 0.254: W1-C2.2 W1-R2.2 54.86,39.93 v52.43,37.49
S_PWM_1
  Top 0.254: IC0.32 37.69,58.29 37.72,58.29 38.05,58.62 62.28,58.62 SERVO_1.2
S_PWM_2
  Top 0.254: IC0.25 37.31,60.07 38.35,59.03 45.45,59.03 45.56,59.13 64.03,59.13 65.35,57.81 SERVO_0.2
SCK  (via drill 0.35)
  Top 0.254: IC0.13 26.44,52.12 v21.64,52.12 | SPI_CONN0.2 66.89,60.64 65.46,62.07 35.71,62.07 35.51,61.87 28.35,61.87 28.04,62.18 28.04,63.4 27.58,63.86 21.79,63.86 21.34,63.4 v21.34,63.09 | v15.24,67.97 10.99,63.72 SPI_CONN1.2
  Bottom 0.254: v21.64,52.12 21.34,52.43 v21.34,63.09 21.34,63.24 16.61,67.97 v15.24,67.97
SCL0
  Bottom 0.254: IC0.19/A5 42.01,49.84 IC2_0_PC.2
SCL1
  Top 0.254: IC0.29 28.49,57.53 27.34,56.39 25.09,56.39 I2C_1_IMU.2
SDA0
  Bottom 0.254: IC0.18/A4 39.32,52.3 IC2_0_PC.1
SDA1
  Top 0.254: I2C_1_IMU.3 25.3,59.94 26.42,58.83 29.92,58.83 31.22,57.53 IC0.30
U0  (via drill 0.35)
  Top 0.254: HB-U0.4 HB-U0.8 24.81,13.31 24.99,13.31 | v19.51,12.5 20.32,13.31 23.57,13.31
  Top 2.032: 24.99,13.31 23.57,13.31 8.84,28.04 MOTOR0.1
  Bottom 0.254: U0-C5.2 23.71,11.89 | U0-C3.2 24.32,10.67 24.32,11.89 23.71,11.89 | 23.71,11.89 20.12,11.89 v19.51,12.5
U1  (via drill 0.35)
  Top 0.254: HB-U1.4 50.09,13.41 50.13,13.45 56.02,13.45 56.06,13.41 HB-U1.8 | v64.9,14.02 64.29,14.02 63.68,13.41 62.77,13.41
  Top 2.032: 62.77,13.41 HB-U1.8 63.38,17.07 64.31,17.07 75.29,28.04 MOTOR1.1
  Bottom 0.254: U1-C5.2 60.72,14.94 | 60.72,14.94 U1-C3.2 | v64.9,14.02 63.98,14.94 60.72,14.94
V0  (via drill 0.35)
  Top 0.254: 24.99,25.91 HB-V0.8 24.08,25.91 23.77,25.6 24.69,25.6 24.99,25.91 | HB-V0.4 24.99,25.91 | v19.51,25.3 19.51,26.82 20.12,27.43
  Top 2.032: HB-V0.8 24.71,26.19 23.47,27.43 20.12,27.43 19.2,28.35 18.24,29.3 16.97,30.58 MOTOR0.2
  Bottom 0.254: V0-C5.2 23.71,24.38 | 23.71,24.38 V0-C3.2 | 23.71,24.38 20.42,24.38 v19.51,25.3
V1  (via drill 0.35)
  Top 0.254: HB-V1.4 HB-V1.8 | v64.92,28.96 64.92,27.13
  Top 2.032: HB-V1.8 60.94,27.13 64.92,27.13 69.19,27.13 72.85,30.79 76,30.79 MOTOR1.2
  Bottom 0.254: V1-C3.2 60.72,28.04 | 60.72,28.04 V1-C5.2 | v64.92,28.96 64.01,28.04 60.72,28.04
VCC  (via drill 0.55)
  Top 1.016: v62.81,52.15 60.1,52.15 IC0.VIN
  Bottom 0.508: SERVO_1.3 64.11,54.25 64.31,54.25
  Bottom 1.016: U1.3 73.15,19.3 73.15,39.32 64.31,48.16 64.31,52.12 | 64.31,52.12 64.31,54.25 65.33,55.27 SERVO_0.3 | v62.81,52.15 64.29,52.15 64.31,52.12
VI  (via drill 0.35)
  Top 0.152: 34.79,29.74 HB-V0.7
  Top 0.254: v34.14,30.79 34.65,30.28 34.65,29.88 34.79,29.74 | v25.3,44.2 31.39,44.2 33.27,42.32 34.71,42.32 HB-W0.7 | HB-U1.7 50.69,8.53 v50.9,8.53 | HB-V1.7 50.69,21.03 v51.82,21.03 | HB-U0.7 33.74,18.29 v32.38,18.29
  Top 0.406: HB-W1.7 50.38,33.83 51.51,33.83 v51.82,33.53
  Top 0.889: HB-W0.7 40.39,42.22 42.06,40.54 | HB-W1.7 42.22,34.59 42.06,34.44 | HB-V0.7 41.91,29.72 42.06,29.87 | HB-U0.7 41.6,17.22 42.06,16.76 | HB-V1.7 42.22,22.1 42.06,22.25 | HB-U1.7 42.22,9.6 42.06,9.75
  Top 2.032: U$5.VCC 9.18,13.91 C0.+ 16.76,13.91 16.76,4.27 41.66,4.27 | 41.66,4.27 42.06,4.67 42.06,9.75 42.06,16.76 42.06,22.25 42.06,29.87 42.06,34.44 42.06,40.54 | U1.1 68.68,4.27 41.66,4.27
  Bottom 0.254: v34.14,30.79 22.86,30.79 22.06,29.98 V0-C4.1 V0-C5.1 | U0-C5.1 23.71,15.11 U0-C4.1 23.71,17.31 24.69,18.29 v32.38,18.29 | v25.3,44.2 23.77,44.2 22.01,42.43 W0-C4.1 W0-C5.1 | V1-C5.1 V1-C4.1 62.42,21.57 61.89,21.03 v51.82,21.03 | v50.9,8.53 61.51,8.53 U1-C4.1 U1-C5.1 | W1-C5.1 62.3,38.29 62.3,34.6 W1-C4.1
  Bottom 0.406: v51.82,33.53 52.12,33.22 61.27,33.22 62.15,34.11 W1-C4.1
W0  (via drill 0.35)
  Top 0.254: HB-W0.8 HB-W0.4 | v19.43,37.8 22.11,37.8 22.72,38.41
  Top 2.032: HB-W0.8 22.72,38.41 17.43,33.12 MOTOR0.3
  Bottom 0.254: W0-C5.2 23.71,36.88 | 23.71,36.88 W0-C3.2 | 23.71,36.88 20.65,36.88 19.73,37.8 v19.43,37.8
W1  (via drill 0.35)
  Top 0.254: HB-W1.4 63.03,38.41 63.53,38.91 | v64.92,39.93 63.72,38.72
  Top 2.032: HB-W1.8 63.03,38.41 | 63.53,38.91 63.72,38.72 69.32,33.12 MOTOR1.3
  Bottom 0.254: W1-C5.2 60.72,39.93 | 60.72,39.93 W1-C3.2 | 60.72,39.93 v64.92,39.93